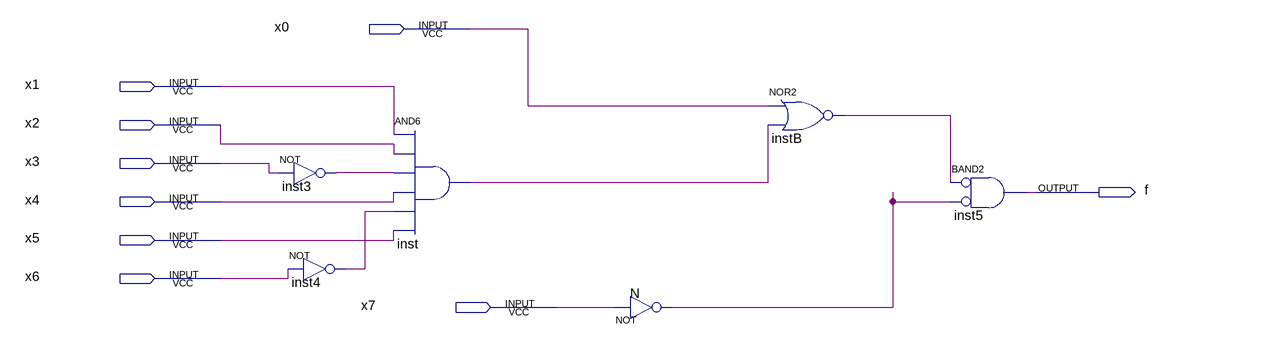
[diagram p0: schematic sheet]
// Quartus schematic Q-100.bdf as structural Verilog: 6 symbols, 9 pins
module \Q-100  (
  input  x0,
  input  x1,
  input  x2,
  input  x3,
  input  x4,
  input  x5,
  input  x6,
  input  x7,
  output f
);

  wire inst3_out, inst4_out, inst_out, instB_out, N_out;

  not inst3 (inst3_out, x3);
  not inst4 (inst4_out, x6);
  and inst (inst_out, x1, x2, inst3_out, x4, inst4_out, x5);
  not N (N_out, x7);
  nor instB (instB_out, x0, inst_out);
  and inst5 (f, ~instB_out, ~N_out);  // BAND2
endmodule
